# Altium schematic sheet Sensor.SchDoc
size A
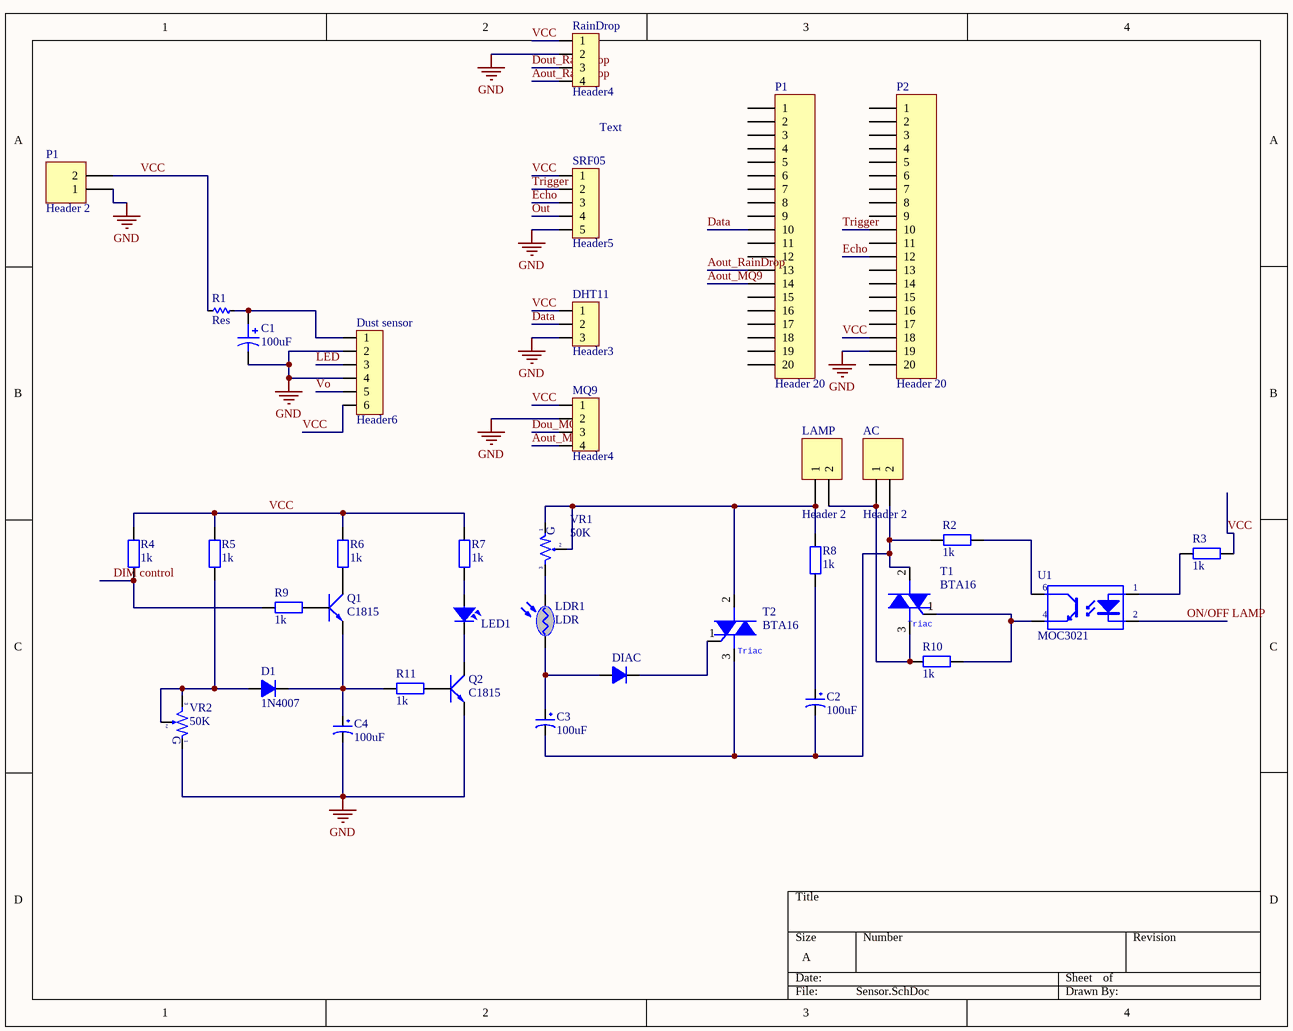
[diagram p0: Sensor.SchDoc]

## Parts
(Parts that share a designator on the sheet are numbered #1, #2 ... from top to bottom, then left to right.)
AC  Header 2  [TBlock 2]
C1  value 100uF  [RADIAL C]  (hidden comment: Cap Pol)
C2  100uF  [Cap-P-7.5/18BL]
C3  100uF  [Cap-P-7.5/18BL]
C4  100uF  [Cap-P-7.5/18BL]
D1  1N4007  [D1A]
DHT11  Header3  [HDR3]
DIAC  Diode  [DO-35]  (value not drawn)
Dust_sensor  Header6  [HDR6]
LAMP  Header 2  [TBlock 2]
LDR1  LDR  [CDS]
LED1  LED  [LED-3MM-YELLOW]  (value not drawn)
MQ9  Header4  [HDR4]
P1#1  Header 20  [Header 20]
P1#2  Header 2  [TBlock 2]
P2  Header 20  [Header 20]
Q1  C1815  [TO92-123]
Q2  C1815  [TO92-123]
R1  Res  [RES-1/2W]
R2  1k  [Res1/4W]
R3  1k  [Res1/4W]
R4  1k  [Res1/4W]
R5  1k  [Res1/4W]
R6  1k  [Res1/4W]
R7  1k  [Res1/4W]
R8  1k  [Res1/4W]
R9  1k  [Res1/4W]
R10  1k  [Res1/4W]
R11  1k  [Res1/4W]
RainDrop  Header4  [HDR4]
SRF05  Header5  [HDR5]
T1  BTA16  [TO-220N]
T2  BTA16  [TO-220N]
U1  MOC3021  [DIP6]
VR1  50K  [VR-S3]
VR2  50K  [VR-S3]

## Nets
GND: C1.2 C4.2 DHT11.3 Dust_sensor.2 Dust_sensor.4 MQ9.2 P1#2.1 P2.19 Q2.1(E) RainDrop.2 SRF05.5 VR2.1
Aout_MQ9: MQ9.4 P1#1.14
Aout_RainDrop: P1#1.13 RainDrop.4
Data: DHT11.2 P1#1.10
DIM control: R4.1 R9.2
Dou_MQ9: MQ9.3
Dout_RainDrop: RainDrop.3
Echo: P2.12 SRF05.3
LED: Dust_sensor.3
ON/OFF LAMP: U1.2(K)
Out: SRF05.4
Trigger: P2.10 SRF05.2
VCC: DHT11.1 Dust_sensor.6 MQ9.1 P1#2.2 P2.18 R1.2 R3.1 R4.2 R5.2 R6.2 R7.2 RainDrop.1 SRF05.1
Vo: Dust_sensor.5
NetAC_1: AC.1 LAMP.2 R10.2 T1.3(A2)
NetAC_2: AC.2 C2.2 C3.2 R2.2 T1.2(A1) T2.3(A2)
NetC1_1: C1.1 Dust_sensor.1 R1.1
NetC2_1: C2.1 R8.1
NetC3_1: C3.1 DIAC.1(A) LDR1.1(A)
NetC4_1: C4.1 D1.2(K) Q1.1(E) R11.2
NetD1_1: D1.1(A) R5.1 VR2.2 VR2.3
NetDIAC_2: DIAC.2(K) T2.1(G)
NetLAMP_1: LAMP.1 R8.2 T2.2(A1) VR1.1 VR1.2
NetLDR1_2: LDR1.2(K) VR1.3
NetLED1_1: LED1.1 R7.1
NetLED1_2: LED1.2 Q2.2(C)
NetQ1_2: Q1.2(C) R6.1
NetQ1_3: Q1.3(B) R9.1
NetQ2_3: Q2.3(B) R11.1
NetR2_1: R2.1 U1.6(C)
NetR3_2: R3.2 U1.1(A)
NetR10_1: R10.1 T1.1(G) U1.4(E)

Not connected (* = marked no-connect by the designer): P1#1 1 2 3 4 5 6 7 8 9 11 12 15 16 17 18 19 20; P2 1 2 3 4 5 6 7 8 9 11 13 14 15 16 17 20

## Notes on the sheet
- Text
- (in symbol VR-S) G

## Library data of the parts
AC LAMP P1#2 = Header 2: Header, 2-Pin; LatestRevisionDate: 17-Jul-2002; LatestRevisionNote: Re-released for DXP Platform.; Publisher: Altium Limited
C1 = Cap Pol: Polarized Capacitor; Published: 8-Jun-2000; LatestRevisionDate: 17-Jul-2002; LatestRevisionNote: Re-released for DXP Platform.; PackageReference: POLAR0.8; Publisher: Altium Limited
C2-C4 = Cap Pol
D1 = Diode 1A: Value: 1N4007
DHT11 = Header3: Header IDC, 3 x 1 Pin Vertical 2.54mm Pitch (Non-Boxed, Male); Manufacturer: W¨¹rth Elektronik eiSos GmbH; partNo: 613002143121; ComponentLink1 Description: Manufacturer; ComponentLink2 Description: Datasheet; NoPins: 02; Created Date: 29 March 2013; ComponentLink1URL: http://www.we-online.com; ComponentLink2URL: http://katalog.we-online.de/em/datasheet/6130xx143121.pdf; Created by: Karrer Zheng
DIAC = Diode: Vendor: Digikey; Value: FRxxx; Published: 8-Jun-2000; LatestRevisionDate: 17-Jul-2002; LatestRevisionNote: Re-released for DXP Platform.; DatasheetDocument: 1997; PackageReference: DO-35; Publisher: Altium Limited; Code_JEDEC: DO-204-AH; ComponentLink1Description: Digikey Part Link; ComponentLink1URL: http://www.fairchildsemi.com/; ComponentLink2Description: Open Datasheet; ComponentLink2URL: H:\LIBRARY\LIBRARY.Datasheet\ds26003.pdf
Dust_sensor = Header6: Header IDC, 6 x 1 Pin Vertical 2.54mm Pitch (Non-Boxed, Male); Manufacturer: W¨¹rth Elektronik eiSos GmbH; partNo: 613002143121; ComponentLink1 Description: Manufacturer; ComponentLink2 Description: Datasheet; NoPins: 02; Created Date: 29 March 2013; ComponentLink1URL: http://www.we-online.com; ComponentLink2URL: http://katalog.we-online.de/em/datasheet/6130xx143121.pdf; Created by: Karrer Zheng
LDR1 = LDR: Quang Tro
LED1 = LED: LED Single colour Green and Red; Value: LED 3 ly Single Colour
MQ9 RainDrop = Header4: Header IDC, 4 x 1 Pin Vertical 2.54mm Pitch (Non-Boxed, Male); Manufacturer: W¨¹rth Elektronik eiSos GmbH; partNo: 613002143121; ComponentLink1 Description: Manufacturer; ComponentLink2 Description: Datasheet; NoPins: 02; Created Date: 29 March 2013; ComponentLink1URL: http://www.we-online.com; ComponentLink2URL: http://katalog.we-online.de/em/datasheet/6130xx143121.pdf; Created by: Karrer Zheng
P1#1 P2 = Header 20: Header, 20-Pin; LatestRevisionDate: 17-Jul-2002; LatestRevisionNote: Re-released for DXP Platform.; Publisher: Altium Limited
Q1 Q2 = C1815: NPN 600mW, ECB; Value: C1815
R1 = Res: Manufacturer: Generic Components; Class: Passive; SubClass: R; Published: 08/06/2000; Publisher: Altium Hobart Technology Centre
R2-R11 = Res1/4W: Resistor; Value: R1/4W - 1K
SRF05 = Header5: Header IDC, 5 x 1 Pin Vertical 2.54mm Pitch (Non-Boxed, Male); Manufacturer: W¨¹rth Elektronik eiSos GmbH; partNo: 613002143121; ComponentLink1 Description: Manufacturer; ComponentLink2 Description: Datasheet; NoPins: 02; Created Date: 29 March 2013; ComponentLink1URL: http://www.we-online.com; ComponentLink2URL: http://katalog.we-online.de/em/datasheet/6130xx143121.pdf; Created by: Karrer Zheng
T1 T2 = BTA16: Triac; ComponentLink2Description: Open Datasheet; ComponentLink2URL: H:\LIBRARY\LIBRARY.Datasheet\
U1 = MOC3021: Single Opto; Value: MOC3021
VR1 VR2 = VR-S: Var Resistor; Value: Volume 50k